# EAGLE schematic NodeMCU_SMD1206 (EAGLE 9.6.2)
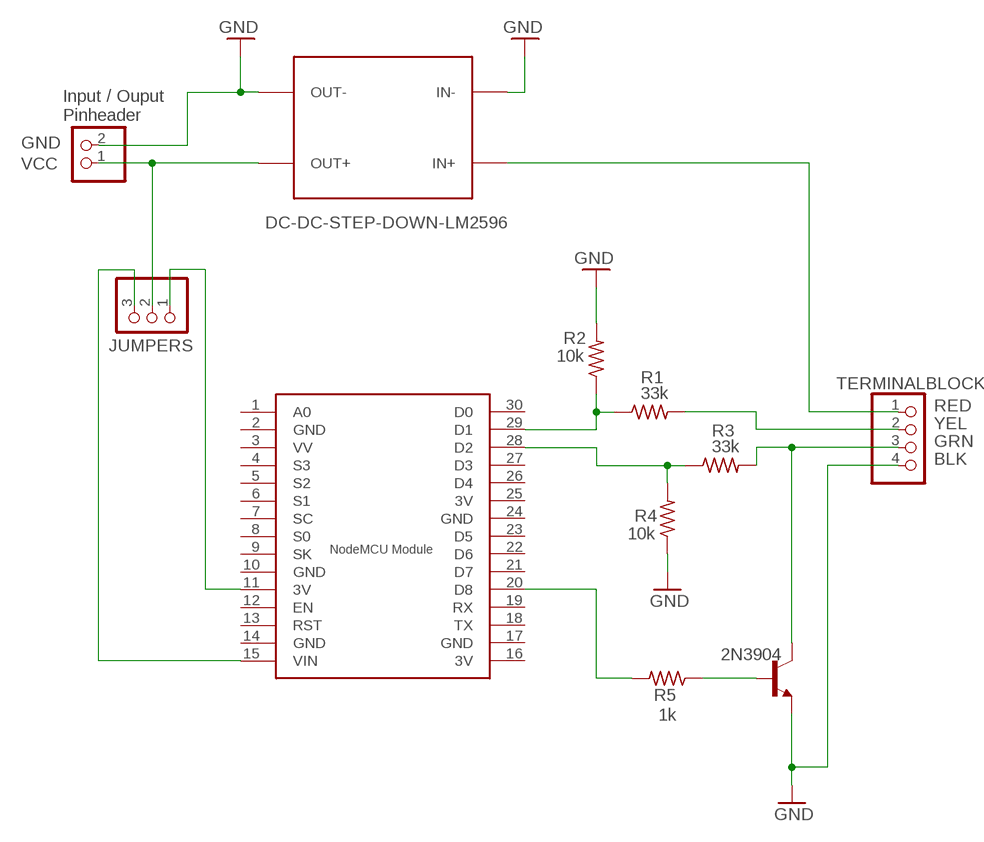
[diagram p0: schematic, sheet 1]

## Parts
JP2  PINHD-1X2  [1X02]
JUMPERS  PINHD-1X3  [1X03]
R1  33k  R-US_R1206  [R1206]
R2  10k  R-US_R1206  [R1206]
R3  33k  R-US_R1206  [R1206]
R4  10k  R-US_R1206  [R1206]
R5  1k  R-US_R1206  [R1206]
T1  2N3904  [TO92]
TERMINALBLOCK  PINHD-1X4  [1X04]
U$1  NODEMCU  [NODEMCU]
U$2  DC-DC-STEP-DOWN-LM2596  [DC-DC-STEP-DOWN-LM2596]

## Nets
GND: JP2.2 R2.2 R4.1 T1.3(E) TERMINALBLOCK.4 U$2.IN- U$2.OUT-
N$1: R1.1 R2.1 U$1.29(D1)
N$2: R1.2 TERMINALBLOCK.2
N$3: R3.1 R4.2 U$1.28(D2)
N$4: R3.2 T1.1(C) TERMINALBLOCK.3
N$5: TERMINALBLOCK.1 U$2.IN+
N$6: JP2.1 JUMPERS.2 U$2.OUT+
N$7: R5.1 T1.2(B)
N$8: R5.2 U$1.20(D8)
N$9: JUMPERS.3 U$1.15(VIN)
N$10: JUMPERS.1 U$1.11(3V)
Unconnected: U$1.1(A0) U$1.3(VV) U$1.4(S3) U$1.5(S2) U$1.6(S1) U$1.7(SC) U$1.8(S0) U$1.9(SK) U$1.12(EN) U$1.13(RST) U$1.18(TX) U$1.19(RX) U$1.21(D7) U$1.22(D6) U$1.23(D5) U$1.26(D4) U$1.27(D3) U$1.30(D0)

## Notes on the sheet
- Input / Ouput
  Pinheader
- GND
- VCC
- RED
- YEL
- GRN
- BLK
- NodeMCU Module

## Power pins joined to a net without a drawn wire
3V: U$1.16(3V) U$1.25(3V)
GND: U$1.2(GND) U$1.10(GND) U$1.14(GND) U$1.17(GND) U$1.24(GND)

## Library data of the parts
JP2 = pinhead:PINHD-1X2: PIN HEADER
JUMPERS = pinheadDSC1:PINHD-1X3: PIN HEADER
R1-R5 = rcl:R-US_: RESISTOR, American symbol; SPICEPREFIX: R
T1 = transistor:2N3904: NPN TRANSISTOR
TERMINALBLOCK = pinhead:PINHD-1X4: PIN HEADER
U$1 = nodemcu:NODEMCU
U$2 = diy-modules:DC-DC-STEP-DOWN-LM2596: DC/DC Step-Down Regulator based on LM2596-ADJ chip LM2596 datasheet available here: http://www.ti.com/lit/ds/symlink/lm2596.pdf Click here to find device on ebay.com <http://www.ebay.com/sch/lm2596+power+regulator>